# EAGLE design v1 (EAGLE 7.2.0)

## Sheet 1 of 5: USB Input
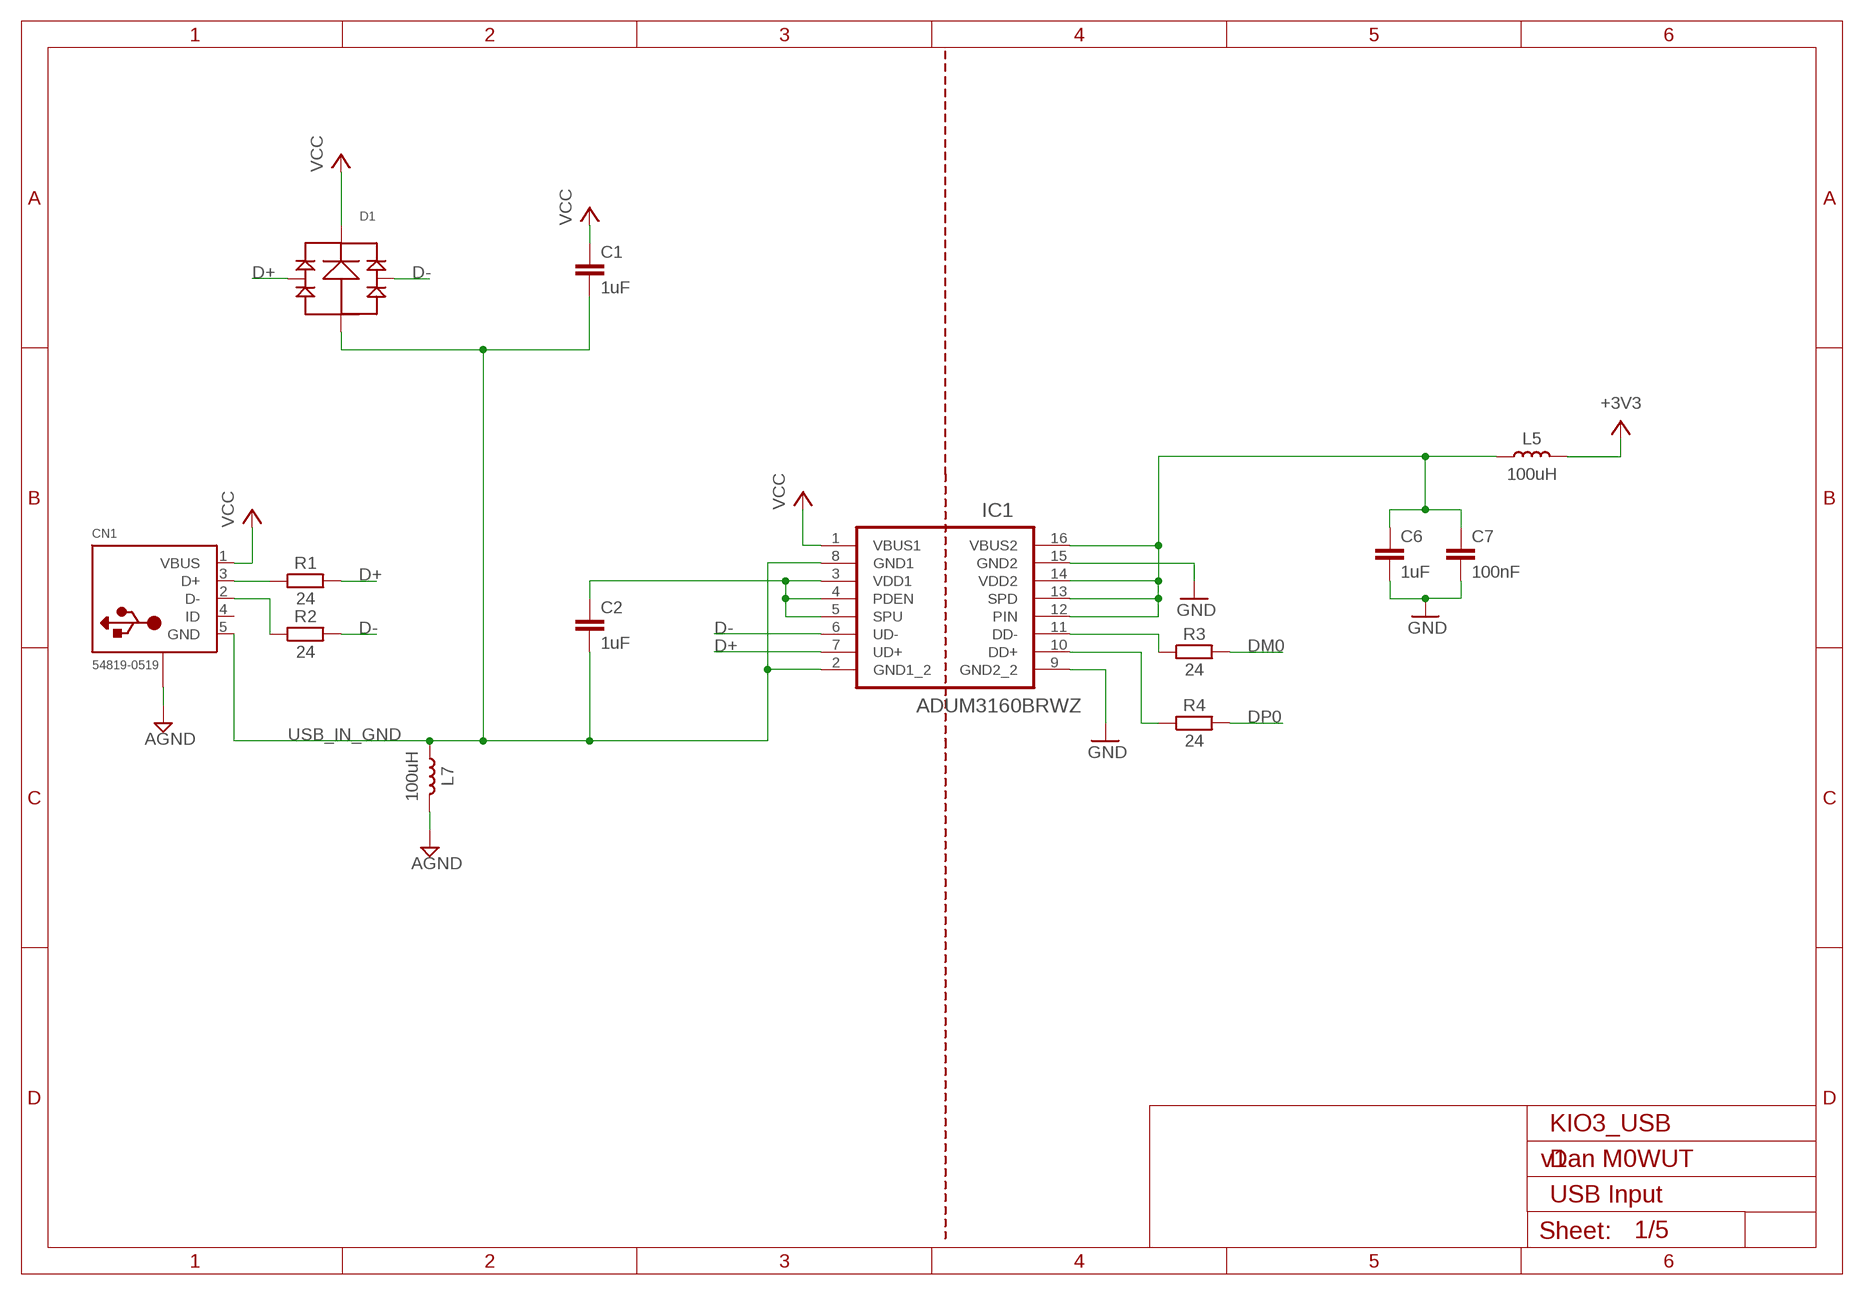
[diagram p0: schematic, sheet 1]

### Parts
C1  1uF  C-EUC0402  [C0402]
C2  1uF  C-EUC0402  [C0402]
C6  1uF  C-EUC0402  [C0402]
C7  100nF  C-EUC0402  [C0402]
CN1  54819-0519  USBMOLEX_MINI  [CONN_USB_MOLEX_MINI]
D1  D_ST_USBULC6  [UQFN6]
IC1  ADUM3160BRWZ  [SOIC127P1032X265-16N]
L5  100uH  INDUCTOR  [R0805]
L7  100uH  INDUCTOR  [R0805]
R1  24  R-EU_R0402  [R0402]
R2  24  R-EU_R0402  [R0402]
R3  24  R-EU_R0402  [R0402]
R4  24  R-EU_R0402  [R0402]

### Nets
+3V3: L5.2 ; also sheet 2,5
AGND: CN1.TAB1(SHIELD) CN1.TAB(SHIELD) L7.2 ; also sheet 2,5
D+: D1.1(LEFT) D1.6(LEFT) IC1.7(UD+) R1.2
D-: D1.3(RIGHT) D1.4(RIGHT) IC1.6(UD-) R2.2
DM0: R3.2 ; also sheet 2
DP0: R4.2 ; also sheet 2
GND: C6.2 C7.2 IC1.9(GND2_2) IC1.15(GND2) ; also sheet 2,3,5
N$1: CN1.3(D+) R1.1
N$2: CN1.2(D-) R2.1
N$9: C2.1 IC1.3(VDD1) IC1.4(PDEN) IC1.5(SPU)
N$10: IC1.11(DD-) R3.1
N$11: IC1.10(DD+) R4.1
N$19: C6.1 C7.1 IC1.12(PIN) IC1.13(SPD) IC1.14(VDD2) IC1.16(VBUS2) L5.1
USB_IN_GND: C1.2 C2.2 CN1.5(GND) D1.2(GND) IC1.2(GND1_2) IC1.8(GND1) L7.1
VCC: C1.1 CN1.1(VBUS) D1.5(V+) IC1.1(VBUS1)
Unconnected: CN1.4(ID)

### Notes on the sheet
- KIO3_USB
- Dan M0WUT
- USB Input

## Sheet 2 of 5: USB Hub
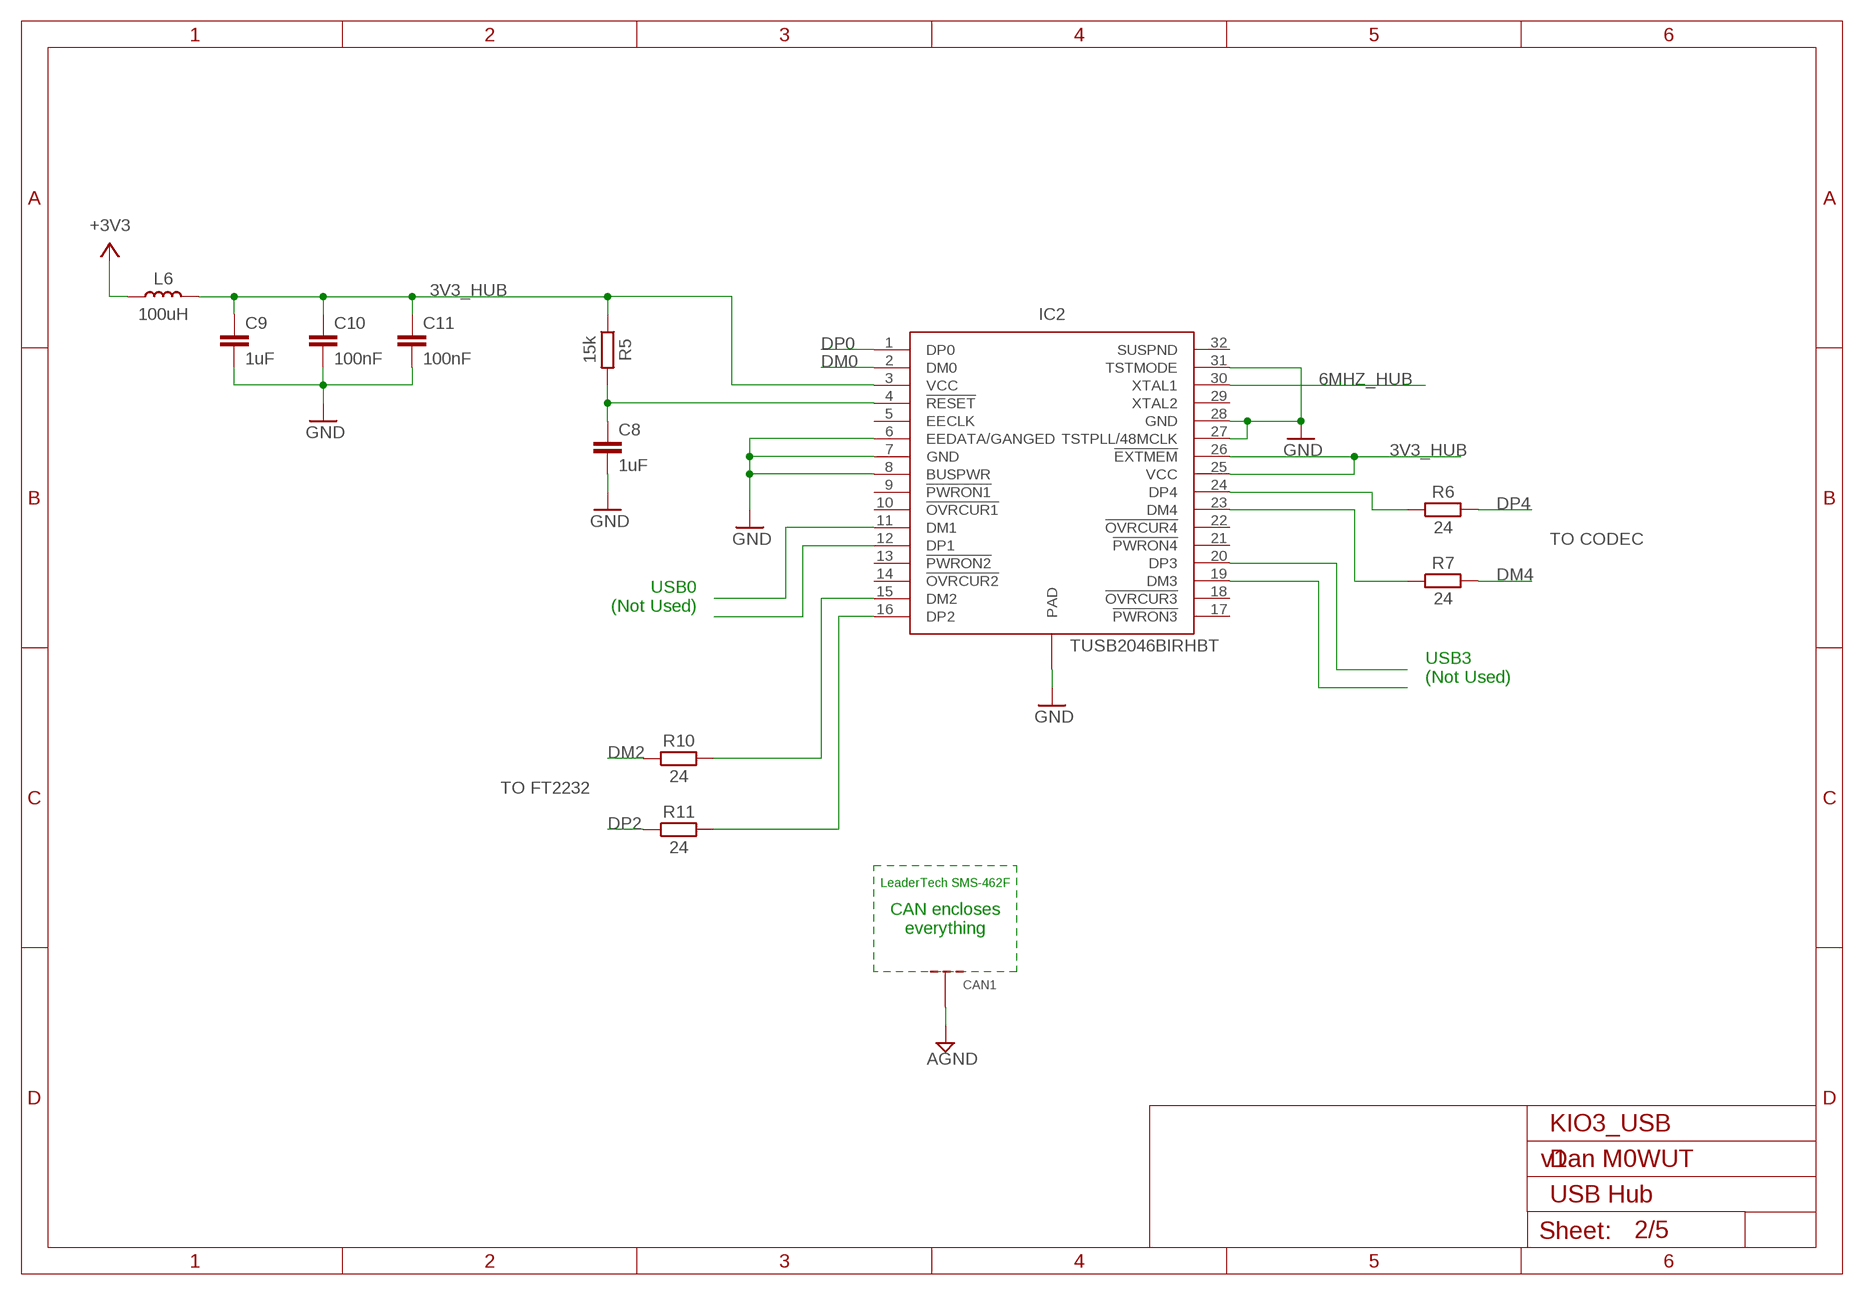
[diagram p1: schematic, sheet 2]

### Parts
C8  1uF  C-EUC0402  [C0402]
C9  1uF  C-EUC0402  [C0402]
C10  100nF  C-EUC0402  [C0402]
C11  100nF  C-EUC0402  [C0402]
CAN1  SHIELDING_CAN  [CAN_LEADER_SMS462]
IC2  TUSB2046BIRHBT  TUSB2046BIRHBIRHB  [RHB_S-PQFP-N32]
L6  100uH  INDUCTOR  [R0805]
R5  15k  R-EU_R0402  [R0402]
R6  24  R-EU_R0402  [R0402]
R7  24  R-EU_R0402  [R0402]
R10  24  R-EU_R0402  [R0402]
R11  24  R-EU_R0402  [R0402]

### Nets
3V3_HUB: C9.1 C10.1 C11.1 IC2.3(VCC) IC2.25(VCC) IC2.26(!EXTMEM) L6.2 R5.1
6MHZ_HUB: IC2.30(XTAL1)
+3V3: L6.1 ; also sheet 1,5
AGND: CAN1.P$1 CAN1.P$2 CAN1.P$3 CAN1.P$4 CAN1.P$5 CAN1.P$6 CAN1.P$7 CAN1.P$8 CAN1.P$9 CAN1.P$10 CAN1.P$11 CAN1.P$12 CAN1.P$13 CAN1.P$14 CAN1.P$15 CAN1.P$16 CAN1.P$17 CAN1.P$18 CAN1.P$19 CAN1.P$20 CAN1.P$21 CAN1.P$22 CAN1.P$23 CAN1.P$24 CAN1.P$25 CAN1.P$26 CAN1.P$27 CAN1.P$28 CAN1.P$29 CAN1.P$30 CAN1.P$31 CAN1.P$32 CAN1.P$33 CAN1.P$34 CAN1.P$35 CAN1.P$36 CAN1.P$37 CAN1.P$38 CAN1.P$39 CAN1.P$40 CAN1.P$41 CAN1.P$42 CAN1.P$43 CAN1.P$44 CAN1.P$45 CAN1.P$46 CAN1.P$47 CAN1.P$48 CAN1.P$49 CAN1.P$50 CAN1.P$51 CAN1.P$52 CAN1.P$53 CAN1.P$54 CAN1.P$55 CAN1.P$56 CAN1.P$57 CAN1.P$58 CAN1.P$59 CAN1.P$60 CAN1.P$61 CAN1.P$62 CAN1.P$63 CAN1.P$64 CAN1.P$65 CAN1.P$66 CAN1.P$67 CAN1.P$68 ; also sheet 1,5
DM0: IC2.2(DM0) ; also sheet 1
DM2: R10.1 ; also sheet 3
DM4: R7.2
DP0: IC2.1(DP0) ; also sheet 1
DP2: R11.1 ; also sheet 3
DP4: R6.2
GND: C8.2 C9.2 C10.2 C11.2 IC2.6(EEDATA/GANGED) IC2.7(GND) IC2.8(BUSPWR) IC2.27(TSTPLL/48MCLK) IC2.28(GND) IC2.31(TSTMODE) IC2.EXP(PAD) ; also sheet 1,3,5
N$3: C8.1 IC2.4(!RESET) R5.2
N$12: IC2.11(DM1)
N$13: IC2.12(DP1)
N$14: IC2.15(DM2) R10.2
N$15: IC2.16(DP2) R11.2
N$16: IC2.20(DP3)
N$17: IC2.19(DM3)
USB4_N: IC2.23(DM4) R7.1
USB4_P: IC2.24(DP4) R6.1
Unconnected: IC2.5(EECLK) IC2.9(!PWRON1) IC2.10(!OVRCUR1) IC2.13(!PWRON2) IC2.14(!OVRCUR2) IC2.17(!PWRON3) IC2.18(!OVRCUR3) IC2.21(!PWRON4) IC2.22(!OVRCUR4) IC2.29(XTAL2) IC2.32(SUSPND)

### Notes on the sheet
- TO CODEC
- USB0
  (Not Used)
- USB3
  (Not Used)
- TO FT2232
- LeaderTech SMS-462F
- CAN encloses
  everything
- KIO3_USB
- Dan M0WUT
- USB Hub

## Sheet 3 of 5: FT2232
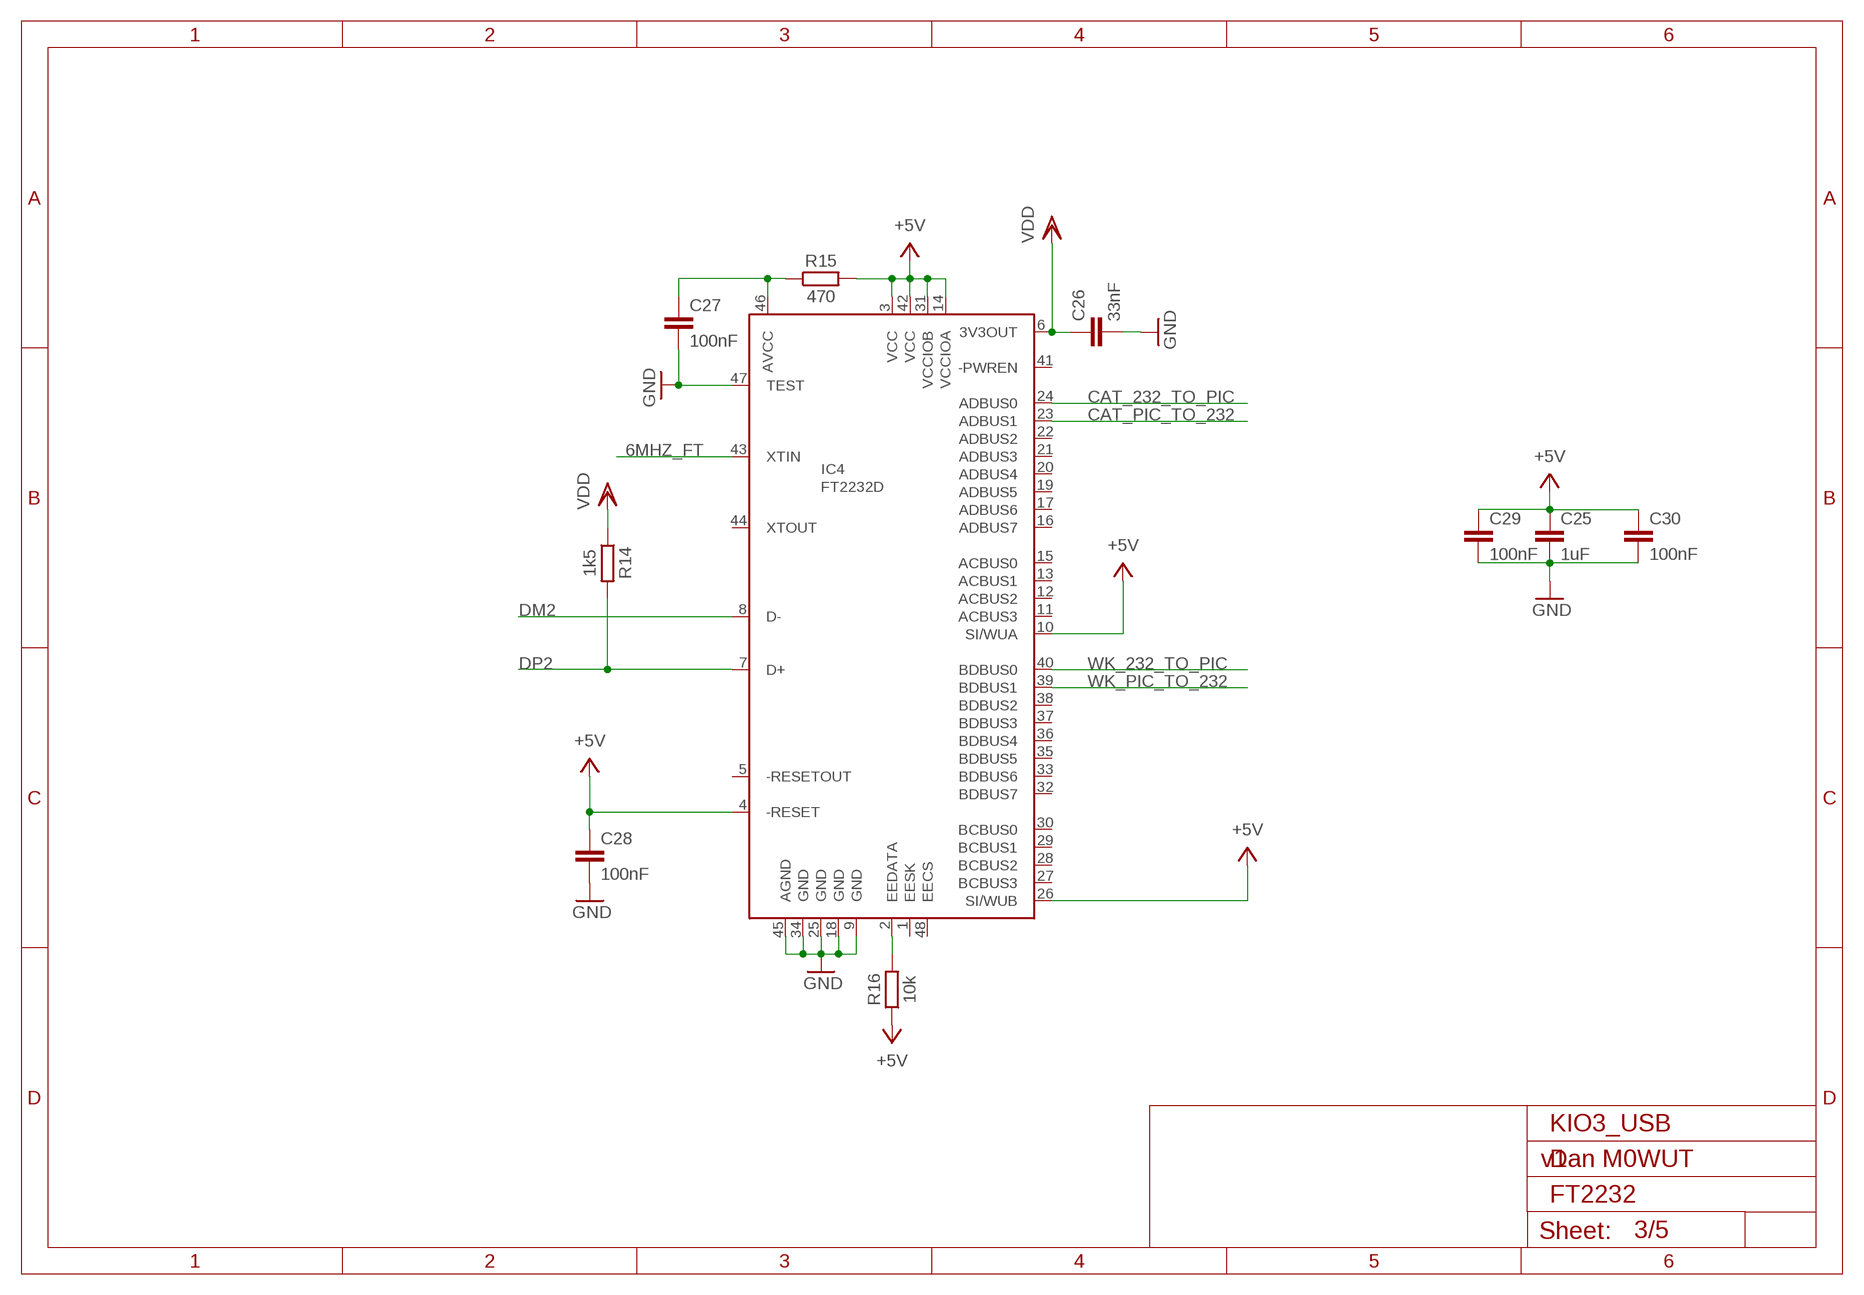
[diagram p2: schematic, sheet 3]

### Parts
C25  1uF  C-EUC0402  [C0402]
C26  33nF  C-EUC0402  [C0402]
C27  100nF  C-EUC0402  [C0402]
C28  100nF  C-EUC0402  [C0402]
C29  100nF  C-EUC0402  [C0402]
C30  100nF  C-EUC0402  [C0402]
IC4  FT2232D  [QFP48-7X7]
R14  1k5  R-EU_R0402  [R0402]
R15  470  R-EU_R0402  [R0402]
R16  10k  R-EU_R0402  [R0402]

### Nets
6MHZ_FT: IC4.43(XTIN)
+5V: C25.1 C28.1 C29.1 C30.1 IC4.3(VCC) IC4.4(-RESET) IC4.10(SI/WUA) IC4.14(VCCIOA) IC4.26(SI/WUB) IC4.31(VCCIOB) IC4.42(VCC) R15.2 R16.1 ; also sheet 5
CAT_232_TO_PIC: IC4.24(ADBUS0)
CAT_PIC_TO_232: IC4.23(ADBUS1)
DM2: IC4.8(D-) ; also sheet 2
DP2: IC4.7(D+) R14.2 ; also sheet 2
GND: C25.2 C26.2 C27.2 C28.2 C29.2 C30.2 IC4.9(GND) IC4.18(GND) IC4.25(GND) IC4.34(GND) IC4.45(AGND) IC4.47(TEST) ; also sheet 1,2,5
N$33: C27.1 IC4.46(AVCC) R15.1
N$37: IC4.2(EEDATA) R16.2
VDD: C26.1 IC4.6(3V3OUT) R14.1
WK_232_TO_PIC: IC4.40(BDBUS0)
WK_PIC_TO_232: IC4.39(BDBUS1)
Unconnected: IC4.1(EESK) IC4.5(-RESETOUT) IC4.11(ACBUS3) IC4.12(ACBUS2) IC4.13(ACBUS1) IC4.15(ACBUS0) IC4.16(ADBUS7) IC4.17(ADBUS6) IC4.19(ADBUS5) IC4.20(ADBUS4) IC4.21(ADBUS3) IC4.22(ADBUS2) IC4.27(BCBUS3) IC4.28(BCBUS2) IC4.29(BCBUS1) IC4.30(BCBUS0) IC4.32(BDBUS7) IC4.33(BDBUS6) IC4.35(BDBUS5) IC4.36(BDBUS4) IC4.37(BDBUS3) IC4.38(BDBUS2) IC4.41(-PWREN) IC4.44(XTOUT) IC4.48(EECS)

### Notes on the sheet
- KIO3_USB
- Dan M0WUT
- FT2232

## Sheet 4 of 5: PIC
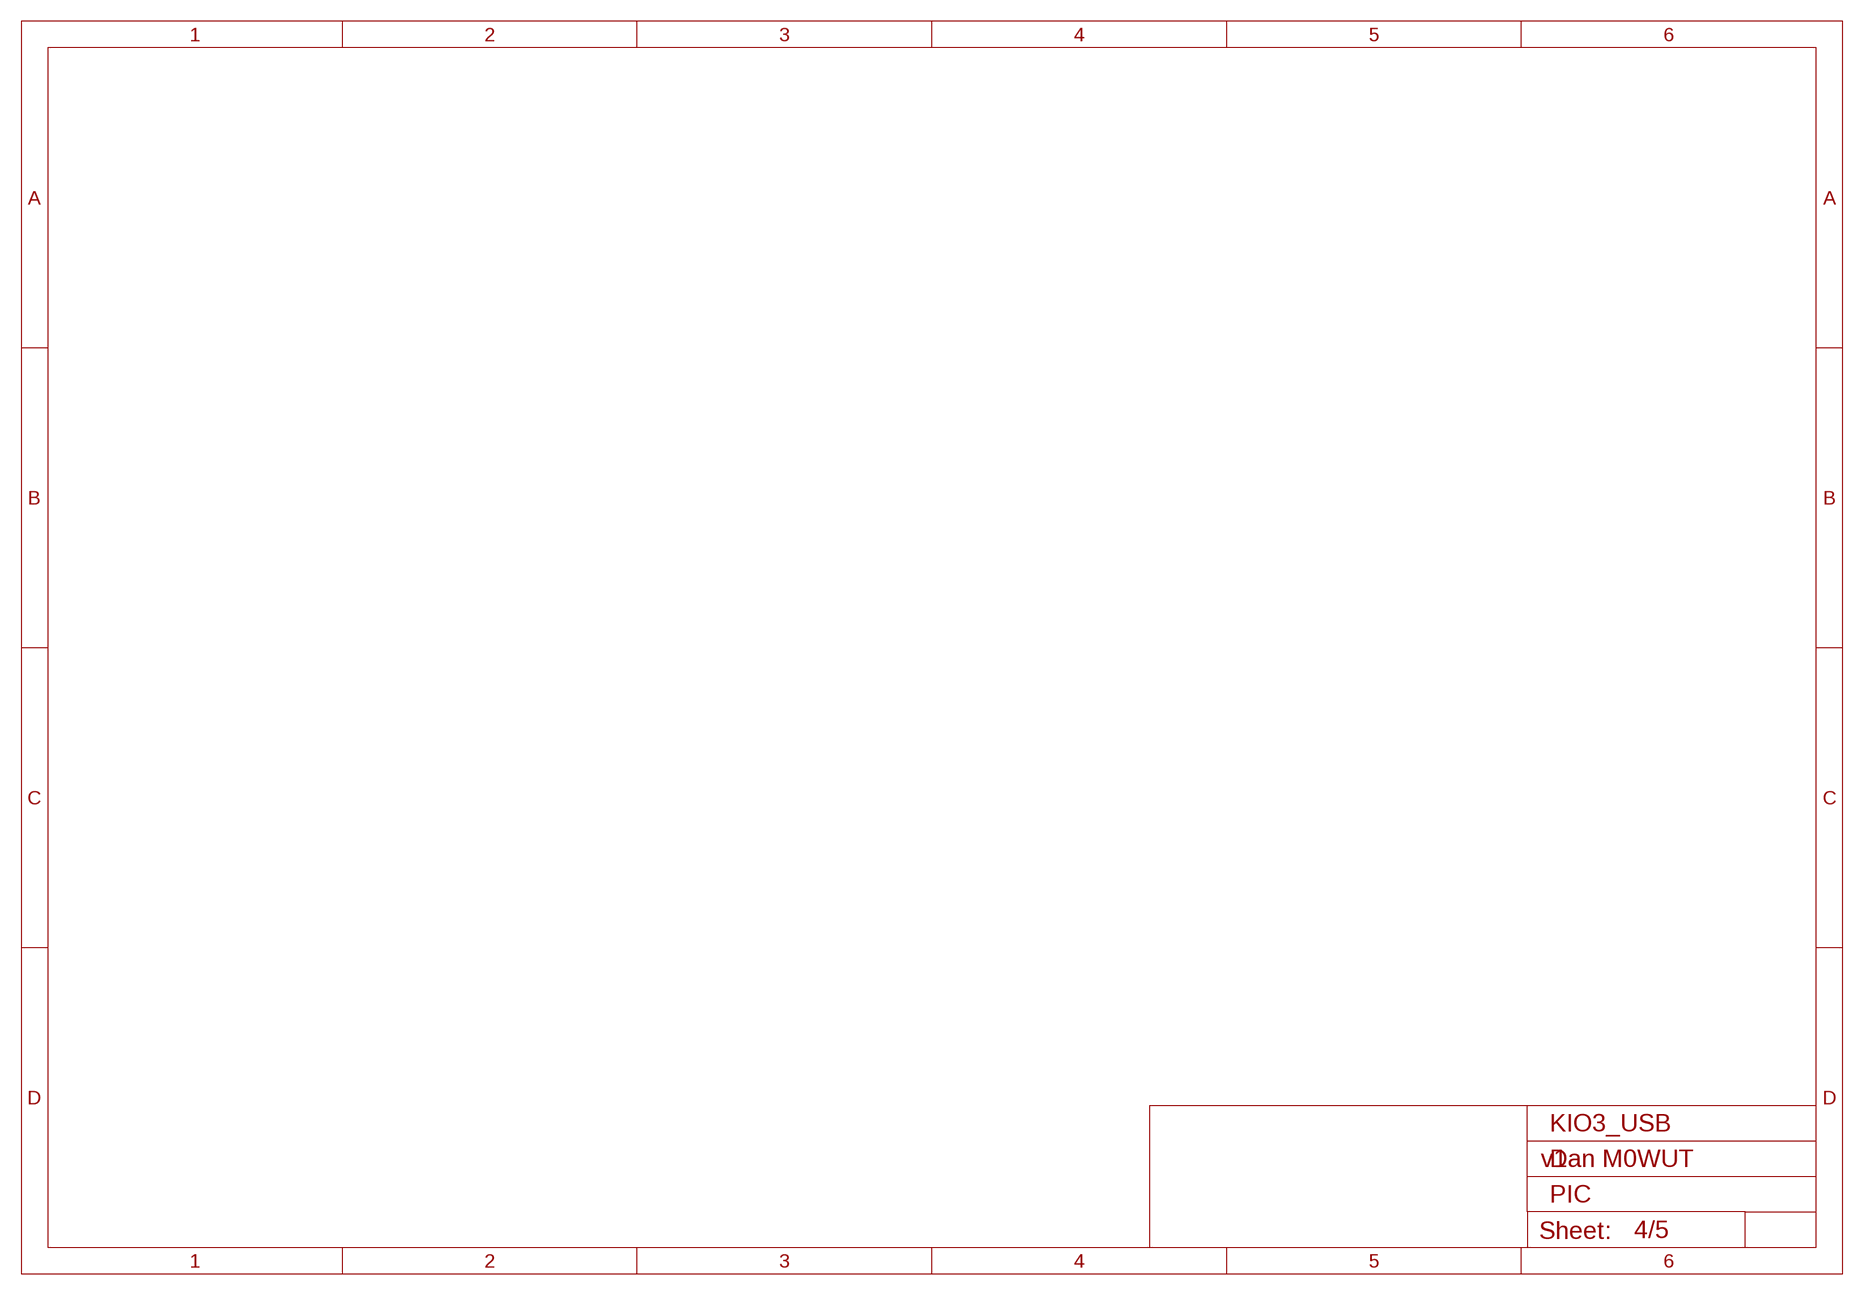
[diagram p3: schematic, sheet 4]

### Notes on the sheet
- KIO3_USB
- Dan M0WUT
- PIC

## Sheet 5 of 5: Connectors
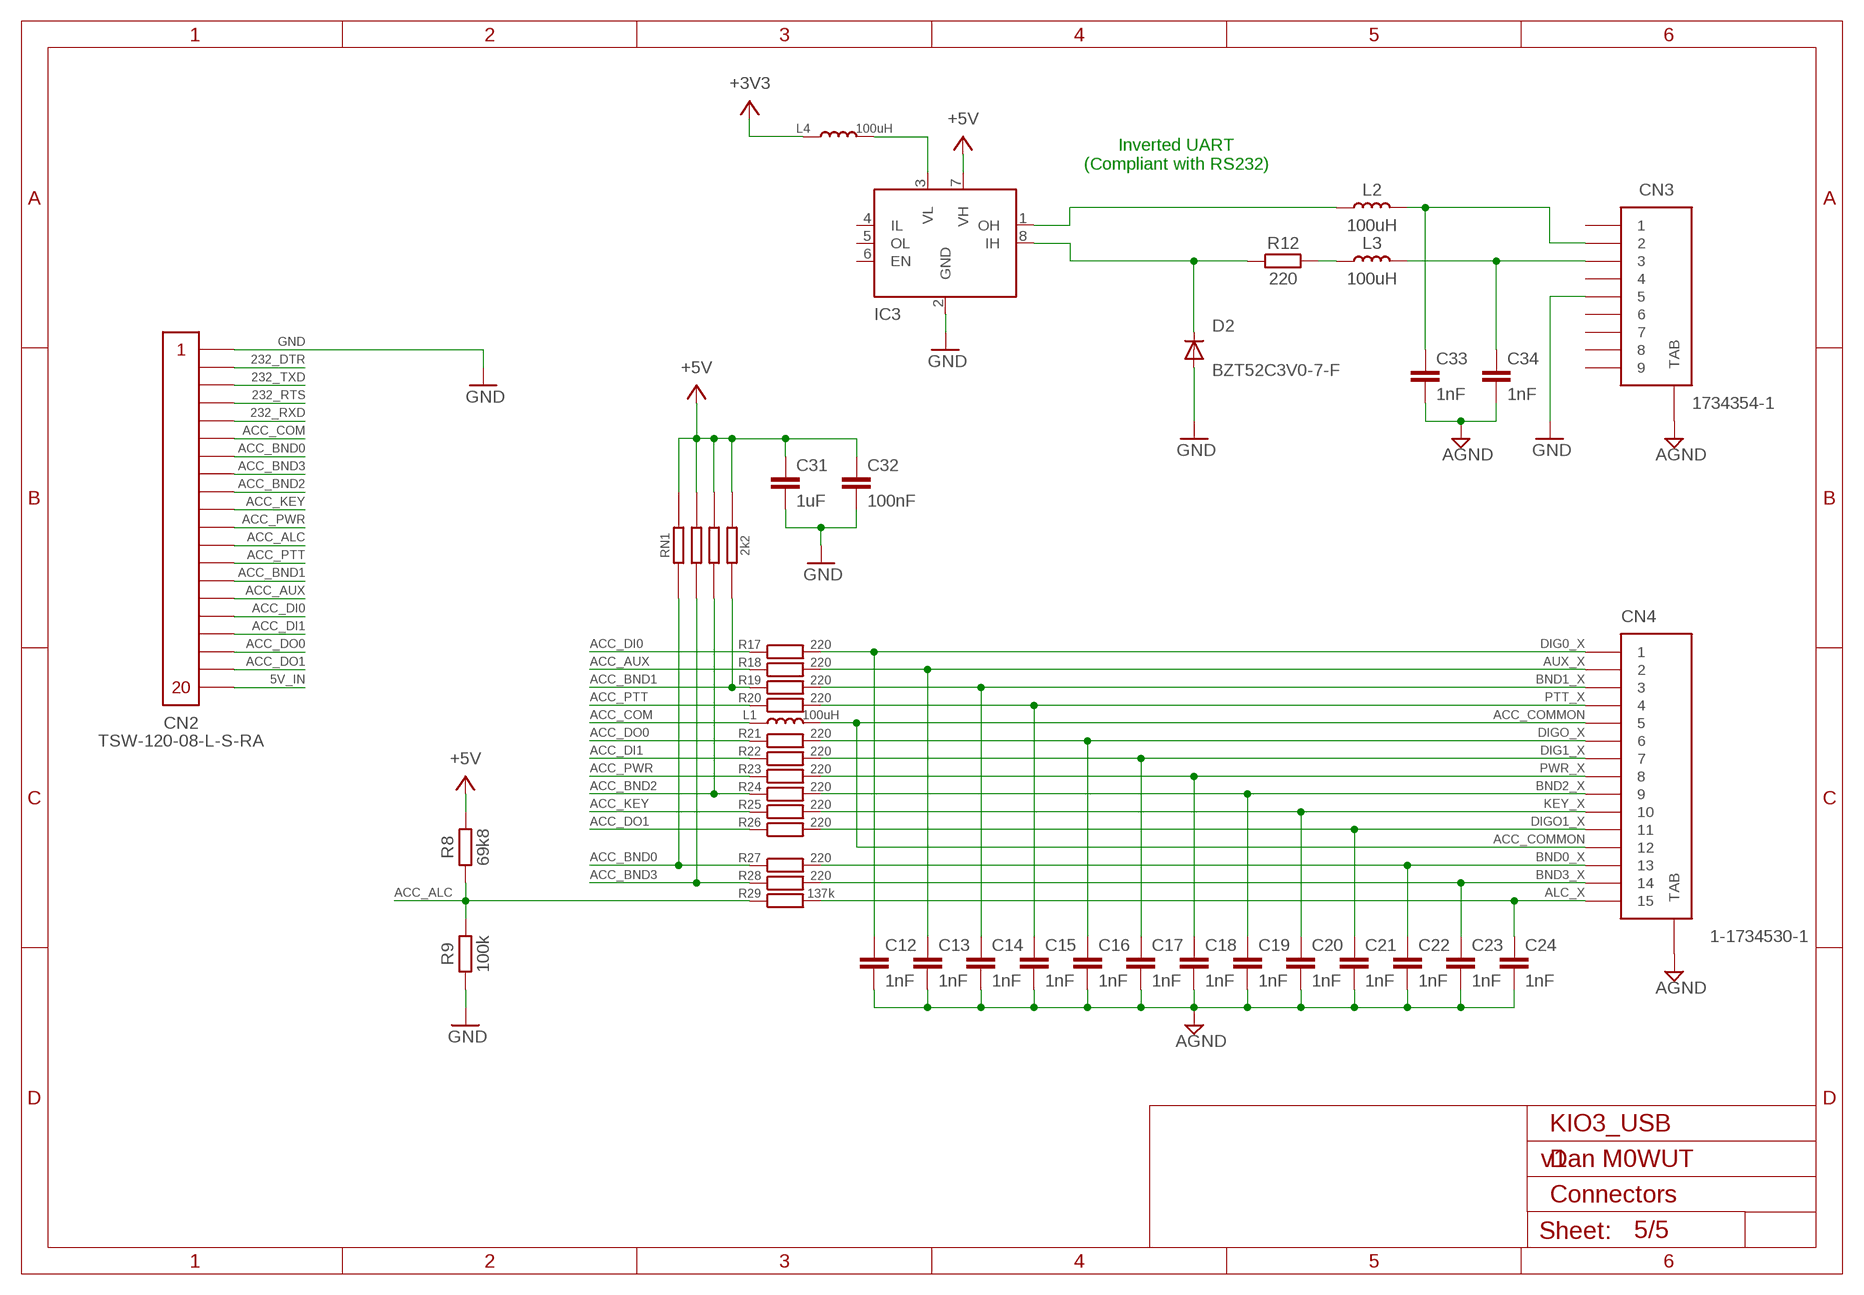
[diagram p4: schematic, sheet 5]

### Parts
C12  1nF  C-EUC0402  [C0402]
C13  1nF  C-EUC0402  [C0402]
C14  1nF  C-EUC0402  [C0402]
C15  1nF  C-EUC0402  [C0402]
C16  1nF  C-EUC0402  [C0402]
C17  1nF  C-EUC0402  [C0402]
C18  1nF  C-EUC0402  [C0402]
C19  1nF  C-EUC0402  [C0402]
C20  1nF  C-EUC0402  [C0402]
C21  1nF  C-EUC0402  [C0402]
C22  1nF  C-EUC0402  [C0402]
C23  1nF  C-EUC0402  [C0402]
C24  1nF  C-EUC0402  [C0402]
C31  1uF  C-EUC0402  [C0402]
C32  100nF  C-EUC0402  [C0402]
C33  1nF  C-EUC0402  [C0402]
C34  1nF  C-EUC0402  [C0402]
CN2  TSW-120-08-L-S-RA  CONN_0.1"_1X20  [CONN_0.1_1X20]
CN3  1734354-1  CONN_TE_DB9  [CONN_TE_DE9]
CN4  1-1734530-1  CONN_TE_DB-HD15  [CONN_TE_DE-HD15]
D2  BZT52C3V0-7-F  DIODESOD-123  [SOD-123]
IC3  IC_MAX3375  [SOT23-8L]
L1  100uH  INDUCTOR  [R0805]
L2  100uH  INDUCTOR  [R0805]
L3  100uH  INDUCTOR  [R0805]
L4  100uH  INDUCTOR  [R0805]
R8  69k8  R-EU_R0402  [R0402]
R9  100k  R-EU_R0402  [R0402]
R12  220  R-EU_R0402  [R0402]
R17  220  R-EU_R0805  [R0805]
R18  220  R-EU_R0805  [R0805]
R19  220  R-EU_R0805  [R0805]
R20  220  R-EU_R0805  [R0805]
R21  220  R-EU_R0805  [R0805]
R22  220  R-EU_R0805  [R0805]
R23  220  R-EU_R0805  [R0805]
R24  220  R-EU_R0805  [R0805]
R25  220  R-EU_R0805  [R0805]
R26  220  R-EU_R0805  [R0805]
R27  220  R-EU_R0805  [R0805]
R28  220  R-EU_R0805  [R0805]
R29  137k  R-EU_R0805  [R0805]
RN1  2k2  R_BOURNS_CAY16-J4  [R_BOURNS_CAY16-J4]

### Nets
5V_IN: CN2.P$20
232_DTR: CN2.P$2
232_RTS: CN2.P$4
232_RXD: CN2.P$5
232_TXD: CN2.P$3
+3V3: L4.1 ; also sheet 1,2
+5V: C31.1 C32.1 IC3.7(VH) R8.2 RN1.1 RN1.2 RN1.3 RN1.4 ; also sheet 3
ACC_ALC: CN2.P$12 R8.1 R9.2 R29.1
ACC_AUX: CN2.P$15 R18.1
ACC_BND0: CN2.P$7 R27.1 RN1.1A
ACC_BND1: CN2.P$14 R19.1 RN1.4A
ACC_BND2: CN2.P$9 R24.1 RN1.3A
ACC_BND3: CN2.P$8 R28.1 RN1.2A
ACC_COM: CN2.P$6 L1.1
ACC_COMMON: CN4.5 CN4.12 L1.2
ACC_DI0: CN2.P$16 R17.1
ACC_DI1: CN2.P$17 R22.1
ACC_DO0: CN2.P$18 R21.1
ACC_DO1: CN2.P$19 R26.1
ACC_KEY: CN2.P$10 R25.1
ACC_PTT: CN2.P$13 R20.1
ACC_PWR: CN2.P$11 R23.1
AGND: C12.2 C13.2 C14.2 C15.2 C16.2 C17.2 C18.2 C19.2 C20.2 C21.2 C22.2 C23.2 C24.2 C33.2 C34.2 CN3.TAB CN3.TAB1(TAB) CN4.16(TAB) CN4.17(TAB) ; also sheet 1,2
ALC_X: C24.1 CN4.15 R29.2
AUX_X: C13.1 CN4.2 R18.2
BND0_X: C22.1 CN4.13 R27.2
BND1_X: C14.1 CN4.3 R19.2
BND2_X: C19.1 CN4.9 R24.2
BND3_X: C23.1 CN4.14 R28.2
DIG0_X: C12.1 CN4.1 R17.2
DIG1_X: C17.1 CN4.7 R22.2
DIGO1_X: C21.1 CN4.11 R26.2
DIGO_X: C16.1 CN4.6 R21.2
GND: C31.2 C32.2 CN2.P$1 CN3.5 D2.A IC3.2(GND) R9.1 ; also sheet 1,2,3
KEY_X: C20.1 CN4.10 R25.2
N$4: C34.1 CN3.3 L3.2
N$6: L3.1 R12.2
N$7: IC3.3(VL) L4.2
N$18: C33.1 CN3.2 L2.2
N$188: IC3.1(OH) L2.1
N$189: D2.C IC3.8(IH) R12.1
PTT_X: C15.1 CN4.4 R20.2
PWR_X: C18.1 CN4.8 R23.2
Unconnected: CN3.1 CN3.4 CN3.6 CN3.7 CN3.8 CN3.9 IC3.4(IL) IC3.5(OL) IC3.6(EN)

### Notes on the sheet
- Inverted UART
  (Compliant with RS232)
- KIO3_USB
- Dan M0WUT
- Connectors

## Library data of the parts
C1 C2 C6-C34 = rcl:C-EU: CAPACITOR, European symbol
CAN1 = m0wut:SHIELDING_CAN
CN1 = m0wut:USB: USB Connectors USBMINIB - Surface Mount Female Mini-B USB Connector 4UConnector: 06564 By microbuilder.eu Thru-hole RA Female Mini-B USB Connector 4UConnector: 18732 By ladyada.net
CN2 = m0wut:CONN_0.1"_1X20
CN3 = m0wut:CONN_TE_DB9: TE: 1734354-1 Farnell: 1653978
CN4 = m0wut:CONN_TE_DB-HD15: TE: 1-1734530-1 Farnell: 2293881
D1 = m0wut:D_ST_USBULC6
D2 = adafruit:DIODE: Diode SMADIODE - SMA Surface Mount Package 20V 1A Schottky Diode Digikey: 641-1014-6-ND DO-1N4148 - Through Hole Small Current Diode SOD-123 20V 1 A (.5mV Vf) Schottky Diode - Digikey: MBRX120TPMSCT-ND SOD-323 10V 570mA (.38mV Vf, 3ns) Schottky Diode - Digikey: ZLLS410CT-ND SOD-523 30V 30mA Schottky Diode (RB751S-40TE61) - Digikey: RB751S-40TE61CT-ND SOT23-R/W - SOT23 Package (R = Solder Paste/Reflow Ovens, W = Hand-Soldering) BAT54Film 40V 300mA - Digikey: 497-7162-1-ND
IC1 = m0wut:ADUM3160BRWZ: Full/Low Speed 2.5 kV USB Digital Isolator; MPN: ADUM3160BRWZ; OC_FARNELL: 1843660; OC_NEWARK: 85R6420; PACKAGE: SOIC-16; SUPPLIER: Analog Devices
IC2 = texas:TUSB2046BIRHB: 4-PORT HUB FOR THE UNIVERSAL SERIAL BUS WITH OPTIONAL SERIAL EEPROM INTERFACE Source: http://focus.ti.com/lit/ds/symlink/tusb2046b.pdf; MPN: TUSB2046BIRHBT; OC_FARNELL: 1610201; OC_NEWARK: 14N8499
IC3 = m0wut:IC_MAX3375
IC4 = ftdichip-3:FT2232D: FT2232 DUAL USB UART/FIFO (4th Gen USB 2 full speed)
L1-L7 = m0wut:INDUCTOR
R1-R12 R14-R29 = rcl:R-EU_: RESISTOR, European symbol
RN1 = m0wut:R_BOURNS_CAY16-J4

## Board
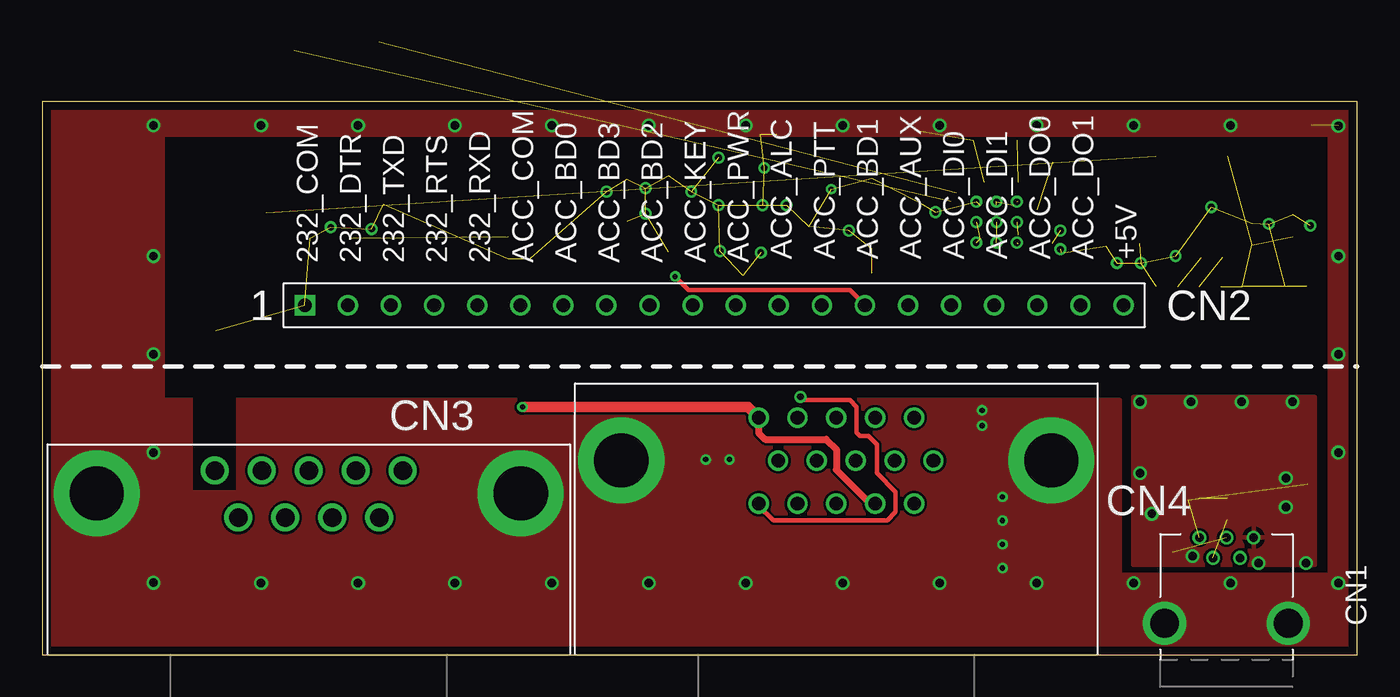
[diagram p5: board, top side]
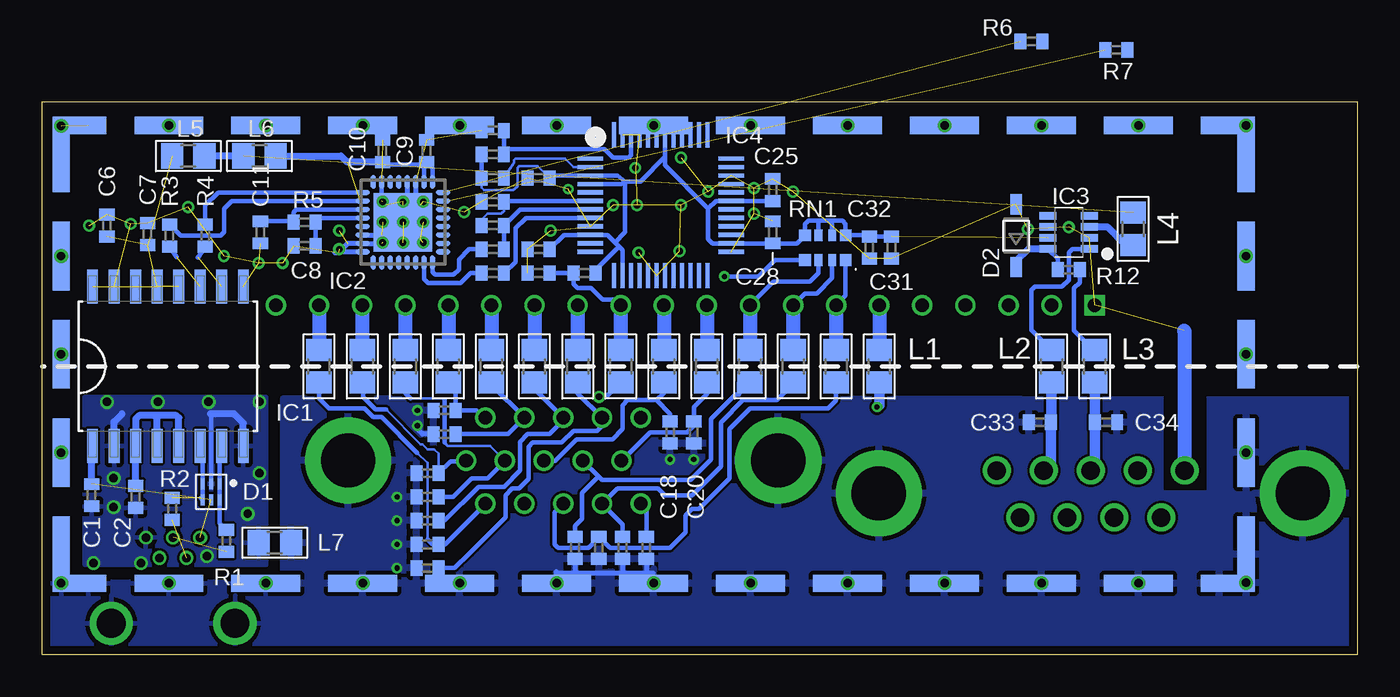
[diagram p6: board, bottom side, seen from below]

Size 77.5 x 32.6 mm. Coordinates in mm from the lower left corner, seen from the top.
Outline: 77.5,0 77.5,32.6 0,32.6 0,0 77.5,0
Copper layers (1*16): Top 0.035mm / dielectric 1.6mm / Bottom 0.035mm
Design rules "Elecrow_2-layer_PCB_eagle_rule": minimum track width 6mil, minimum drill 12mil, track to track 6mil, track to pad 6mil, pad to pad 6mil, via to via 8mil, smd to smd 0mil, copper to edge 20mil, drill to drill 10mil, minimum pad ring 6mil, minimum via ring 6mil, stop-mask expansion 0mil, vias tented up to drill 100mil, thermal gap 10mil
tKeepout: area 14.2,22.1 to 65.1,32.5
tRestrict: area 8.9,9.7 to 11.4,15.4
bRestrict: area 55.5,27.6 to 56,28; area 58.4,23.4 to 58.9,24.8; area 68.5,20.6 to 69.3,24.4; area 29.5,18.7 to 62.5,21.4; area 8.9,9.7 to 11.4,15.4; area 26.9,18.7 to 29.6,21.4; area 48.4,21.4 to 48.7,21.9; area 49.8,21.4 to 50.2,22; area 48.7,21.5 to 49.7,22.5; area 66,24.4 to 66.9,24.8

### Footprints (pad centres in the part's own frame; a part is rotated, then mirrored left to right if it is on the bottom)
C0402 = smd 0.7 x 0.9: 1 -0.65,0; 2 0.65,0
CAN_LEADER_SMS462 = smd 4.064 x 1.016: P$1 6.858,0.508; P$2 12.573,0.508; P$3 18.288,0.508; P$4 24.003,0.508; P$5 29.718,0.508; P$6 35.433,0.508; P$7 41.148,0.508; P$8 46.863,0.508; P$9 52.578,0.508; P$10 58.293,0.508; P$11 64.008,0.508; P$21 64.008,27.508; P$22 58.293,27.508; P$23 52.578,27.508; P$24 46.863,27.508; P$25 41.148,27.508; P$26 35.433,27.508; P$27 29.718,27.508; P$28 24.003,27.508; P$29 18.288,27.508; P$30 12.573,27.508; P$31 6.858,27.508 | smd 1.016 x 4.445: P$12 0.508,2.223; P$13 70.358,2.223; P$32 70.358,25.794; P$33 0.508,25.794 | smd 2.159 x 1.016: P$14 2.095,0.508; P$15 68.77,0.508; P$34 68.77,27.508; P$35 2.095,27.508 | smd 1.016 x 4.039: P$16 0.508,8.217; P$17 0.508,14.008; P$19 0.508,19.799; P$36 70.358,19.799; P$65 70.358,14.008; P$67 70.358,8.217 | drill 0.5: P$18 0.508,14.008; P$20 0.508,19.799; P$37 0.508,0.508; P$38 6.858,0.508; P$39 12.573,0.508; P$40 18.288,0.508; P$41 24.003,0.508; P$42 29.718,0.508; P$43 35.433,0.508; P$44 41.148,0.508; P$45 46.863,0.508; P$46 52.578,0.508; P$47 58.293,0.508; P$48 64.008,0.508; P$49 70.358,0.533; P$50 0.508,8.217; P$51 70.358,27.508; P$52 64.008,27.508; P$53 58.293,27.508; P$54 52.578,27.508; P$55 46.863,27.508; P$56 41.148,27.508; P$57 35.433,27.508; P$58 29.718,27.508; P$59 24.003,27.508; P$60 18.288,27.508; P$61 12.573,27.508; P$62 6.858,27.508; P$63 0.508,27.483; P$64 70.358,19.799; P$66 70.358,14.008; P$68 70.358,8.217
CONN_USB_MOLEX_MINI = drill 0.5: 1 -1.6,7.2; 2 -0.8,6; 3 0,7.2; 4 0.8,6; 5 1.6,7.2 | drill 1.7: TAB -3.65,2.15; TAB1 3.65,2.15
CONN_0.1_1X20 = drill 0.8 square: P$1 0,0 | drill 0.8: P$2 2.54,0; P$3 5.08,0; P$4 7.62,0; P$5 10.16,0; P$6 12.7,0; P$7 15.24,0; P$8 17.78,0; P$9 20.32,0; P$10 22.86,0; P$11 25.4,0; P$12 27.94,0; P$13 30.48,0; P$14 33.02,0; P$15 35.56,0; P$16 38.1,0; P$17 40.64,0; P$18 43.18,0; P$19 45.72,0; P$20 48.26,0
CONN_TE_DE9 = drill 1.1: 1 5.54,10.85; 2 2.77,10.85; 3 0,10.85; 4 -2.77,10.85; 5 -5.54,10.85; 6 4.155,8.08; 7 1.385,8.08; 8 -1.385,8.08; 9 -4.155,8.08 | drill 3.2 pad 5.08: TAB -12.495,9.5; TAB1 12.495,9.5
CONN_TE_DE-HD15 = drill 0.8: 1 4.58,13.97; 2 2.29,13.97; 3 0,13.97; 4 -2.29,13.97; 5 -4.58,13.97; 6 5.725,11.43; 7 3.435,11.43; 8 1.145,11.43; 9 -1.145,11.43; 10 -3.435,11.43; 11 4.58,8.89; 12 2.29,8.89; 13 0,8.89; 14 -2.29,8.89; 15 -4.58,8.89 | drill 3.2 pad 5.08: 16 12.675,11.45; 17 -12.675,11.45
UQFN6 = smd 0.25 x 0.65: 1 -0.5,-0.475; 2 0,-0.475; 3 0.5,-0.475; 4 0.5,0.475; 5 0,0.475; 6 -0.5,0.475
SOD-123 = smd 1.2 x 0.7: A 1.85,0; C -1.85,0
SOIC127P1032X265-16N = smd 1.981 x 0.635: 1 -4.699,4.445; 2 -4.699,3.175; 3 -4.699,1.905; 4 -4.699,0.635; 5 -4.699,-0.635; 6 -4.699,-1.905; 7 -4.699,-3.175; 8 -4.699,-4.445; 9 4.699,-4.445; 10 4.699,-3.175; 11 4.699,-1.905; 12 4.699,-0.635; 13 4.699,0.635; 14 4.699,1.905; 15 4.699,3.175; 16 4.699,4.445
RHB_S-PQFP-N32 = smd 0.85 x 0.3: 1 -2.375,1.75; 2 -2.375,1.25; 3 -2.375,0.75; 4 -2.375,0.25; 5 -2.375,-0.25; 6 -2.375,-0.75; 7 -2.375,-1.25; 8 -2.375,-1.75; 17 2.375,-1.75; 18 2.375,-1.25; 19 2.375,-0.75; 20 2.375,-0.25; 21 2.375,0.25; 22 2.375,0.75; 23 2.375,1.25; 24 2.375,1.75 | smd 0.3 x 0.85: 9 -1.75,-2.375; 10 -1.25,-2.375; 11 -0.75,-2.375; 12 -0.25,-2.375; 13 0.25,-2.375; 14 0.75,-2.375; 15 1.25,-2.375; 16 1.75,-2.375; 25 1.75,2.375; 26 1.25,2.375; 27 0.75,2.375; 28 0.25,2.375; 29 -0.25,2.375; 30 -0.75,2.375; 31 -1.25,2.375; 32 -1.75,2.375 | smd 3.45 x 3.45: EXP 0,0
SOT23-8L = smd 0.45 x 1: 1 -0.975,-1.225; 2 -0.325,-1.225; 3 0.325,-1.225; 4 0.975,-1.225; 5 0.975,1.225; 6 0.325,1.225; 7 -0.325,1.225; 8 -0.975,1.225
QFP48-7X7 = smd 0.25 x 1.5: 1 -2.75,-4.15; 2 -2.25,-4.15; 3 -1.75,-4.15; 4 -1.25,-4.15; 5 -0.75,-4.15; 6 -0.25,-4.15; 7 0.25,-4.15; 8 0.75,-4.15; 9 1.25,-4.15; 10 1.75,-4.15; 11 2.25,-4.15; 12 2.75,-4.15; 25 2.75,4.15; 26 2.25,4.15; 27 1.75,4.15; 28 1.25,4.15; 29 0.75,4.15; 30 0.25,4.15; 31 -0.25,4.15; 32 -0.75,4.15; 33 -1.25,4.15; 34 -1.75,4.15; 35 -2.25,4.15; 36 -2.75,4.15 | smd 1.5 x 0.25: 13 4.15,-2.75; 14 4.15,-2.25; 15 4.15,-1.75; 16 4.15,-1.25; 17 4.15,-0.75; 18 4.15,-0.25; 19 4.15,0.25; 20 4.15,0.75; 21 4.15,1.25; 22 4.15,1.75; 23 4.15,2.25; 24 4.15,2.75; 37 -4.15,2.75; 38 -4.15,2.25; 39 -4.15,1.75; 40 -4.15,1.25; 41 -4.15,0.75; 42 -4.15,0.25; 43 -4.15,-0.25; 44 -4.15,-0.75; 45 -4.15,-1.25; 46 -4.15,-1.75; 47 -4.15,-2.25; 48 -4.15,-2.75
R0805 = smd 1.3 x 1.5: 1 -0.95,0; 2 0.95,0
R0402 = smd 0.7 x 0.9: 1 -0.65,0; 2 0.65,0
R_BOURNS_CAY16-J4 = smd 0.7 x 0.7: 1 -1.2,-0.725; 1A -1.2,0.725; 4 1.2,-0.725; 4A 1.2,0.725 | smd 0.45 x 0.7: 2 -0.4,-0.725; 2A -0.4,0.725; 3 0.4,-0.725; 3A 0.4,0.725

### Placement (x,y rotation side)
C1  74.6,9.4 270 bottom
C2  72,9.3 270 bottom
C6  73.7,25.3 90 bottom
C7  71.3,24.8 90 bottom
C8  62.05,24.1 180 bottom
C9  54.85,29.7 90 bottom
C10  57.45,29.7 90 bottom
C11  64.65,24.9 270 bottom
C12  53.8,14.4 180 bottom
C13  53.8,13 180 bottom
C14  54.8,7.9 180 bottom
C15  54.8,5.1 180 bottom
C16  54.8,10.7 180 bottom
C17  54.8,9.3 180 bottom
C18  40.5,13.1 270 bottom
C19  46.1,6.3 270 bottom
C20  39.1,13.1 270 bottom
C21  54.8,6.5 180 bottom
C22  44.7,6.3 270 bottom
C23  43.3,6.3 270 bottom
C24  41.9,6.3 270 bottom
C25  34.45,27.4 90 bottom
C26  50.95,26.7 180 bottom
C27  50.95,30.9 180 bottom
C28  34.45,24.9 90 bottom
C29  48.25,28.1 180 bottom
C30  48.25,23.9 180 bottom
C31  27.45,24 270 bottom
C32  28.75,24 270 bottom
C33  18.7,13.7 180 bottom
C34  14.8,13.7 0 bottom
CAN1  76.9,3.7 0 bottom
CN1  69.8,-0.3 0 top
CN2  15.47,20.6 0 top
CN3  15.7,0 0 top
CN4  46.8,0 0 top
D1  67.55,9.6 180 bottom
D2  20.1,24.7 90 bottom
IC1  70.1,17 90 bottom
IC2  56.25,25.5 0 bottom
IC3  17,24.9 90 bottom
IC4  41.05,26.5 270 bottom
L1  28.17,17 270 bottom
L2  18.01,17 270 bottom
L3  15.47,17 270 bottom
L4  13.2,25.1 270 bottom
L5  68.9,29.4 0 bottom
L6  64.7,29.4 0 bottom
L7  63.8,6.6 0 bottom
R1  66.65,6.7 90 bottom
R2  69.85,8.6 90 bottom
R3  70,24.7 90 bottom
R4  67.9,24.7 90 bottom
R5  62.05,25.5 0 bottom
R6  19.2,36.15 0 bottom  (outside the outline)
R7  14.2,35.65 0 bottom  (outside the outline)
R8  45.55,22.5 0 bottom
R9  48.25,22.5 0 bottom
R10  50.95,22.5 180 bottom
R11  50.95,23.9 180 bottom
R12  17,22.7 0 bottom
R14  50.95,25.3 0 bottom
R15  50.95,29.5 180 bottom
R16  50.95,28.1 0 bottom
R17  53.57,17 270 bottom
R18  51.03,17 270 bottom
R19  48.49,17 270 bottom
R20  45.95,17 270 bottom
R21  58.65,17 270 bottom
R22  56.11,17 270 bottom
R23  40.87,17 270 bottom
R24  35.79,17 270 bottom
R25  38.33,17 270 bottom
R26  61.19,17 270 bottom
R27  30.71,17 270 bottom
R28  33.25,17 270 bottom
R29  43.41,17 270 bottom
RN1  31.35,24 180 bottom

### Tracks (layer width: path | path; a pad name or v marks a point on that pad's centre or on a via)
3V3_HUB  (1 unrouted)
  Bottom 0.254: IC2.25 54.5,28.7 C9.1 55,28.9 | IC2.26 55,28.9 | 55,28.9 57.3,28.9 C10.1 | IC2.3 62.55,26.25 62.7,26.1 R5.1 62.75,25.55 C11.1
  Bottom 0.406: L6.2 59.9,29.4 59.55,29.05 C10.1
+3V3  (1 unrouted)
  Bottom 0.406: L6.1 L5.2
+5V  (1 unrouted)
  Bottom 0.152: R16.1 51.6,27.55 51.45,27.4 49.75,27.4 49.5,27.6 49.5,28.7 49.4,28.8 48.3,28.8 C29.1
  Bottom 0.254: 43.75,24.3 44.2,24.75 IC4.10 46.75,24.75 C30.1 | 43.75,24.3 43.5,24.05 | 43.5,24.05 43.3,23.85 IC4.14 | 43.15,27.9 43.6,28.25 IC4.3 47.25,28.25 C29.1 | IC4.4 43.4,27.75 43.15,27.9 | 43.15,27.9 43.15,24.9 43.75,24.3 | 38.25,26.3 38.25,24.5 38,24.25 IC4.26 C28.1 33.02,24.25 RN1.4 32.55,25.4 32.35,25.6 31.75,25.6 | 38.25,26.3 37.8,26.75 IC4.31 C25.1 | IC4.42 40.8,29.35 | 40.8,29.35 42.25,27.9 43.15,27.9 | 40.8,29.35 40.8,28.85 38.25,26.3 | R16.1 R15.2 | 31.05,25.6 30.35,25.6 30.15,25.4 RN1.1 29.02,24.73 C32.1 C31.1 | 31.05,25.6 31.75,25.6 | RN1.2 30.95,25.5 31.05,25.6 | RN1.3 31.75,25.6 | R8.2 44.85,22.7 43.5,24.05
ACC_ALC
  Bottom 0.254: CN2.P$12 43.75,20.94 44.49,20.94 45.15,21.6 45.95,21.6 46.2,21.85 R8.1 R9.2
  Bottom 0.813: CN2.P$12 R29.1
ACC_AUX
  Bottom 0.813: CN2.P$15 R18.1
ACC_BND0
  Bottom 0.254: RN1.1A 30.15,21.16 CN2.P$7
  Bottom 0.813: CN2.P$7 R27.1
ACC_BND1  (via drill 0.3)
  Top 0.254: v37.3,22.3 38.1,21.5 47.59,21.5 CN2.P$14
  Bottom 0.254: RN1.4A 34.33,23.27 35.3,22.3 v37.3,22.3
  Bottom 0.813: CN2.P$14 R19.1
ACC_BND2
  Bottom 0.254: RN1.3A 31.75,22.5 32.25,22 34.39,22 CN2.P$9
  Bottom 0.813: CN2.P$9 R24.1
ACC_BND3
  Bottom 0.254: RN1.2A 30.95,22.2 31.85,21.3 32.55,21.3 CN2.P$8
  Bottom 0.813: CN2.P$8 R28.1
ACC_COM
  Bottom 0.813: CN2.P$6 L1.1
ACC_COMMON  (via drill 0.3)
  Top 0.406: CN4.5 42.22,13.08 42.6,12.7 46.2,12.7 46.8,12.1 46.8,10.9 48.81,8.89 CN4.12
  Top 0.61: v28.3,14.6 41.59,14.6 CN4.5
  Bottom 0.61: L1.2 28.17,14.73 v28.3,14.6
ACC_DI0
  Bottom 0.813: CN2.P$16 R17.1
ACC_DI1
  Bottom 0.813: CN2.P$17 R22.1
ACC_DO0
  Bottom 0.813: CN2.P$18 R21.1
ACC_DO1
  Bottom 0.813: CN2.P$19 R26.1
ACC_KEY
  Bottom 0.813: CN2.P$10 R25.1
ACC_PTT
  Bottom 0.813: CN2.P$13 R20.1
ACC_PWR
  Bottom 0.813: CN2.P$11 R23.1
AGND  (via drill 0.3)  (1 unrouted)
  Bottom 0.254: 54.6,14.45 C12.2 | CAN1.P$33 CAN1.P$63
  Bottom 0.305: 41.5,4.8 41.9,4.8 | 41.9,4.8 43.3,4.8 | 43.3,4.8 46.1,4.8 | 46.1,4.8 47.2,4.8 47.2,4.9 | 41.9,5.6 41.9,4.8 | 43.3,5.6 43.3,4.8 | 46.1,5.6 46.1,4.8 | 54.4,13 55.1,13 55.3,13.2 | CAN1.P$32 CAN1.P$51 CAN1.P$34
  other vias: 55.4,14.4 55.4,13.5 56.6,5.1 56.6,6.5 56.6,7.9 56.6,9.3 39.1,11.5 40.5,11.5
  pour Bottom: -2,15 63.3,15.1 63.3,-1.9 -2,-2
  pour Top (no thermals): -1,-1 63.5,-1 63.5,15 -1,15
  pour Bottom: 62.9,0 77.5,0 77.5,4.3 62.2,4.3 62.2,0
  pour Top (no thermals): 63,4.7 77.5,4.7 77.5,0 63,0
  pour Top (no thermals): 75.4,4.3 75.9,4.3 75.9,32.7 77.7,32.7 77.7,29.5 78.5,29.5 78.5,3.3 75.4,3.3
  pour Top (no thermals): 6.5,14.6 7.1,14.6 7.1,30.7 78.1,30.7 78.1,33.1 -2.7,33.1 -2.7,15 6.5,15
ALC_X  (via drill 0.4)
  Top 0.254: v44.68,15.2 44.9,15 47.6,15 48,14.6 48,13.1 48.2,12.9 48.7,12.9 49.2,12.4 49.2,10.7 50.3,9.6 50.3,8.4 49.8,7.9 43.1,7.9 42.22,8.78 CN4.15
  Bottom 0.254: C24.1 41.9,8.57 CN4.15 | v44.68,15.2 44.26,15.2 R29.2
AUX_X
  Bottom 0.254: R18.2 51.03,15.91 CN4.2 50.06,13 52.8,13 53,13.2 C13.1
BND0_X
  Bottom 0.254: R27.2 30.71,14.99 31.2,14.5 35.8,14.5 37,13.3 37,10.4 38.8,8.6 39.2,8.6 39.6,8.2 39.6,7.2 40.5,6.3 44.05,6.3 C22.1 44.7,6.9 45.3,6.3 47.1,6.3 47.3,6.5 47.3,8.39 CN4.13
BND1_X
  Bottom 0.254: R19.2 48.49,15.66 CN4.3 46.8,13.8 47.6,13 48.9,13 49.35,12.55 49.35,10.85 50.3,9.9 51.8,9.9 53.8,7.9 C14.1
BND2_X
  Bottom 0.254: 35.79,15.61 R24.2 36.45,16.05 36.45,15.35 36.65,15.35 38.1,13.9 38.1,11.5 39.3,10.3 44.52,10.3 44.73,10.5 | 44.73,10.5 CN4.9 | 44.73,10.5 45.7,9.53 45.7,8 46.1,7.6 C19.1
BND3_X
  Bottom 0.254: R28.2 33.25,15.95 34.2,15 36.2,15 37.5,13.7 37.5,11.1 39.2,9.4 40.8,9.4 41.2,9.8 43.6,9.8 CN4.14 43.3,7.68 C23.1
D+
  Bottom 0.254: IC1.7 67.05,12.18 D1.1 D1.6 67.05,7.75 R1.2
D-  (1 unrouted)
  Bottom 0.254: IC1.6 68.05,12.16 D1.3 D1.4 68.17,9.25
DIG0_X
  Bottom 0.254: 53.46,16.05 R17.2 53.15,15.63 C12.1 51.9,14.4 51.8,14.3 51.71,14.3 CN4.1 51.41,14
DIG1_X
  Bottom 0.152: 53.8,12.5 53.6,12.3 51.1,12.3 CN4.7 | 55.8,15.1 53.9,15.1 53.8,15
  Bottom 0.254: 55.8,15.1 56.1,15.4 R22.2 | 53.8,15 53.8,12.5 | C17.1 53.3,9.3 52.2,10.4 51.27,10.4 CN4.7 50.2,11.39
DIGO1_X
  Bottom 0.152: 54.8,6.8 54.8,11.3 55.4,11.9
  Bottom 0.254: R26.2 61.19,15.09 60.6,14.5 58.5,14.5 58,14 57.5,14 55.4,11.9 | 54.8,6.8 54.5,6.5 C21.1 53.77,6.5 CN4.11
DIGO_X
  Bottom 0.152: 57.25,14.45 55.2,12.4 55.1,12.4 54.8,12.1 54.4,12.1 54.15,11.85 C16.1
  Bottom 0.254: 58.35,16.05 R21.2 58.6,16 58.6,15.2 57.85,14.45 57.25,14.45 | C16.1 53.45,11.4 52.55,11.4 CN4.6
DM0
  Bottom 0.254: IC2.2 66.35,26.75 66.8,26.3 66.8,24.9 67,24.7 69.35,24.7 R3.2
DM2
  Bottom 0.254: IC4.8 49,25.75 49.6,25.15 49.6,23.15 R10.1
DP0
  Bottom 0.254: IC2.1 67.15,27.25 67.9,26.5 R4.2
DP2
  Bottom 0.254: IC4.7 49.35,26.25 R14.2 R11.1
GND  (via drill 0.3, 0.4)  (61 unrouted)
  Bottom 0.254: IC2.28 56,26.65 56.15,26.5 55.25,26.5 | 57.25,24.5 56.25,24.5 | IC2.31 57.5,26.75 57.25,26.5 | IC4.45 42.3,31.45 | IC4.47 43.3,31.45
  Bottom 0.305: IC2.27 55.5,26.75 55.25,26.5 | IC2.28 56,26.75 56.25,26.5 | IC2.6 57.5,24.75 57.25,24.5 | 57.25,24.5 57.5,24.25 IC2.7 59.5,24.25 60.05,23.7 60.25,23.7 60.2,23.75 IC2.8 | 57.25,24.5 57.25,26.5 | 55.25,24.5 56.25,24.5
  Bottom 0.813: CN3.5 10.16,19.06 10.2,19.1
  other vias: 72.3,25.4 66.8,23.5 68.9,26.4 74.75,25.3 39.95,23.8 42.45,26.5 39.85,26.5 39.85,29.3 42.55,28.7 43.85,26.5 64.75,23.1 35.55,27.5 35.55,26 52.65,26.1 33.25,27.3 46.5,27.45 47.55,25 63.35,23.1 60,25 60,23.9 56.25,25.5 55.05,25.5 55.05,26.7 56.25,26.7 57.45,26.7 57.45,25.5 55.05,24.3 57.45,24.3 56.25,24.3 42.35,23.7 38.25,27.3 17,25.2 19.4,25.1
KEY_X
  Bottom 0.254: R25.2 38.33,15.37 39.1,14.6 C20.1 39.1,13.5 39.5,13.1 41.7,13.1 CN4.10
N$1  (1 unrouted)
N$2  (1 unrouted)
N$3
  Bottom 0.254: IC2.4 61.15,25.75 R5.2 C8.1
N$4
  Bottom 0.406: C34.1 15.45,13.78 15.47,13.8
  Bottom 0.61: L3.2 15.45,16.05 C34.1 15.45,11.1 CN3.3
N$6
  Bottom 0.254: L3.1 15.55,17.95 16.7,19.1 16.7,21.6 16.35,21.95 R12.2
N$7
  Bottom 0.406: IC3.3 14.72,25.23 13.65,24.15 L4.2
N$9
  Bottom 0.406: IC1.5 69.47,13.96 69.6,14.1 70.9,14.1 | 70.9,14.1 71.8,14.1 72,13.9 IC1.3 C2.1 | IC1.4 70.73,13.94 70.9,14.1
N$10  (1 unrouted)
  Bottom 0.305: 69.59,23.45 R3.1
N$11  (1 unrouted)
  Bottom 0.305: 68.33,23.43 R4.1
N$14
  Bottom 0.254: 51.7,22.4 R10.2 52.25,22.5 52.85,21.9 54.75,21.9 55,22.15 IC2.15
N$15
  Bottom 0.254: R11.2 52.35,23.9 52.95,23.3 52.95,22.7 53.25,22.4 54.35,22.4 54.5,22.55 IC2.16
N$18
  Bottom 0.406: C33.1 18.01,13.7
  Bottom 0.61: L2.2 18.01,13.74 C33.1 18.05,11.27 CN3.2
N$19  (6 unrouted)
N$33
  Bottom 0.254: C27.1 R15.1 50,29.8 44.35,29.8 43.85,29.3 42.95,29.3 42.8,29.45 IC4.46
N$37
  Bottom 0.152: 50.3,28.35 R16.2 50.1,28.3 50.1,28.4 49.7,29 49.7,29.15 49.6,29.25 46.7,29.25 46.2,28.75 IC4.2 | 50.15,28.1 50.15,28.35
  Bottom 0.254: R16.2 50.15,28.1
N$188
  Bottom 0.254: IC3.1 16.77,23.93 17,23.7 17,22.1 17.4,21.7 19,21.7 19.2,21.5 19.2,19.14 L2.1
N$189
  Bottom 0.254: R12.1 17.65,23.35 IC3.8
  Bottom 0.406: D2.C 20.1,23.2 19.38,23.93 IC3.8
PTT_X
  Bottom 0.254: R20.2 45.95,15.41 CN4.4 44.51,13.49 44.8,13.2 46.2,13.2 46.9,12.5 48.6,12.5 48.85,12.25 48.85,10.35 49.4,9.8 49.8,9.8 50.2,9.4 50.2,8.1 52,6.3 52.3,6 53.2,5.1 C15.1
PWR_X
  Bottom 0.254: R23.2 40.87,15.43 41.3,15 | 41.3,15 43,15 43.3,14.7 43.3,13.3 43.9,12.7 46,12.7 47.27,11.43 CN4.8 | C18.1 40.5,14.2 41.3,15
USB4_N  (1 unrouted)
  Bottom 0.152: IC2.23 53.55,26.75
USB4_P  (1 unrouted)
USB_IN_GND  (via drill 0.5)
  Bottom 0.254: D1.2 67.55,14.15 67.6,14.2
  Bottom 0.406: IC1.8 65.66,13.65 66.2,14.2 67.6,14.2 | 72.8,14.2 73.28,13.72 IC1.2
  other vias: 64.7,14.9 73.3,10.4 73.3,8.7 74.5,5.4 71.7,5.4 67.8,5.8 65.4,8.3 64.7,10.7 67.7,14.9 70.7,14.9 73.7,14.9
  pour Bottom: 64.3,15.2 75,15.2 75,5.3 64.3,5.3
  pour Top: 64.3,5.3 75,5.3 75,15.2 64.3,15.2
VCC  (2 unrouted)
  Bottom 0.406: C1.1 74.6,12.25 IC1.1
VDD
  Bottom 0.152: R14.1 51.6,25.65 51.25,26 50.45,26 50.3,26.15 C26.1
  Bottom 0.254: IC4.6 50.25,26.75 C26.1

### Text on the board
tPlace: 232_COM | 232_DTR | 232_TXD | 232_RTS | 232_RXD | ACC_COM | ACC_BD0 | ACC_BD3 | ACC_BD2 | ACC_KEY | ACC_PWR | ACC_ALC | ACC_PTT | ACC_BD1 | ACC_AUX | ACC_DI0 | ACC_DI1 | ACC_DO0 | ACC_DO1 | +5V
tDocu: Bottom clearance 9.5mm to top of audio board connector